# EAGLE schematic Control Panel High Level (EAGLE 6.5.0)
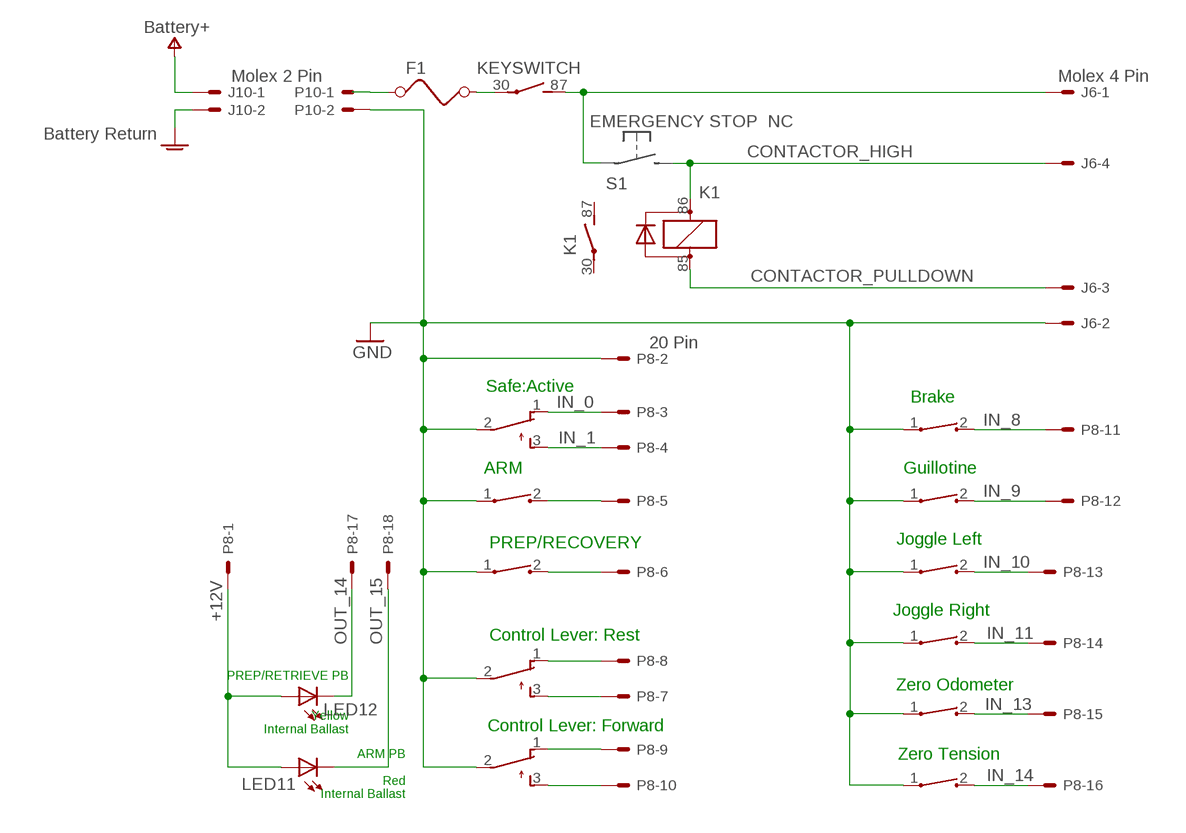
[diagram p0: schematic, sheet 1]

## Parts
F1  FUSE  [FUSE]
J6  Molex 4 Pin  22-23-2041  [22-23-2041]
J10  22-23-2021  [22-23-2021]
K1  CB1-D-P-12V  [CB1]
KEYSWITCH  Starter Relay  CB1A-P-12V  [CB1]
LED11  LED5MM  [LED5MM]
LED12  LED5MM  [LED5MM]
P8  20 Pin  C-GRID-20-70543  [70543-20]
P10  Molex 2 Pin  22-23-2021  [22-23-2021]
S2  TL32PO  [TL3XPO]
S3  TL32PO  [TL3XPO]
S8  TL32PO  [TL3XPO]
SW1  CT10-XXXX-A2  [CT10-XXXX-A2]
SW2  CT10-XXXX-A2  [CT10-XXXX-A2]
SW3  CT10-XXXX-A2  [CT10-XXXX-A2]
SW4  CT10-XXXX-A2  [CT10-XXXX-A2]
SW7  CT10-XXXX-A2  [CT10-XXXX-A2]
SW8  CT10-XXXX-A2  [CT10-XXXX-A2]
SW9  CT10-XXXX-A2  [CT10-XXXX-A2]
SW10  CT10-XXXX-A2  [CT10-XXXX-A2]

## Nets
+12V: LED11.A LED12.A P8.1
BATTERY+: J10.1 ; supply symbol labelled Battery+
CONTACTOR_HIGH: J6.4 K1.86(1:+)
CONTACTOR_PULLDOWN: J6.3 K1.85(1:-)
GND: J6.2 P8.2 P10.2 S2.2(P) S3.2(P) S8.2(P) SW1.1 SW2.1 SW3.1 SW4.1 SW7.1 SW8.1 SW9.1 SW10.1
GNDA: J10.2 ; supply symbol labelled Battery Return
IN_0: P8.3 S8.1(O)
IN_1: P8.4 S8.3(S)
IN_8: P8.11 SW7.2
IN_9: P8.12 SW8.2
IN_10: P8.13 SW9.2
IN_11: P8.14 SW10.2
IN_13: P8.15 SW2.2
IN_14: P8.16 SW1.2
N$1: F1.2 KEYSWITCH.30(2:P)
N$2: J6.1 KEYSWITCH.87(2:S)
N$3: F1.1 P10.1
N$4: P8.10 S3.3(S)
N$5: P8.9 S3.1(O)
N$6: P8.8 S2.1(O)
N$7: P8.7 S2.3(S)
N$8: P8.6 SW4.2
N$9: P8.5 SW3.2
OUT_14: LED12.K(C) P8.17
OUT_15: LED11.K(C) P8.18
Unconnected: K1.30(2:P) K1.87(2:S) KEYSWITCH.85 KEYSWITCH.86 P8.19 P8.20

## Notes on the sheet
- Safe:Active
- Brake
- ARM | Guillotine
- PREP/RECOVERY | Joggle Left
- Joggle Right
- Control Lever: Rest
- PREP/RETRIEVE PB
  
  
  Yellow
  Internal Ballast
- Zero Odometer
- Control Lever: Forward
- ARM PB
  
  Red
  Internal Ballast
- Zero Tension

## Library data of the parts
F1 = special:FUSE: FUSE 5 x 20 mm
J6 = con-molex:22-23-2041: .100" (2.54mm) Center Header - 4 Pin; MF: MOLEX; MPN: 22-23-2041; OC_FARNELL: 1462920; OC_NEWARK: 38C0355
J10 P10 = con-molex:22-23-2021: .100" (2.54mm) Center Header - 2 Pin; MF: MOLEX; MPN: 22-23-2021; OC_FARNELL: 1462926; OC_NEWARK: 25C3832
K1 = relay:CB1*V: HIGH POWER AUTOMOTIVE RELAY Form A with Diode NAiS Source: http://www.mew-europe.com/.. en_ds_61202_0000.pdf; MF: AROMAT/ MATSUSHITA; MPN: CB1-D-P-12V; OC_FARNELL: unknown; OC_NEWARK: 10C5390
KEYSWITCH = relay:CB*: HIGH POWER AUTOMOTIVE RELAY Form A NAiS Source: http://www.mew-europe.com/.. en_ds_61202_0000.pdf; MF: AROMAT/ MATSUSHITA; MPN: CB1A-P-12V; OC_FARNELL: 1270582; OC_NEWARK: 50B849
LED11 LED12 = led:LED: LED OSRAM: - CHIPLED LG R971, LG N971, LY N971, LG Q971, LY Q971, LO R971, LY R971 LH N974, LH R974 LS Q976, LO Q976, LY Q976 LO Q996 - Hyper CHIPLED LW Q18S LB Q993, LB Q99A, LB R99A - SideLED LS A670, LO A670, LY A670, LG A670, LP A670 LB A673, LV A673, LT A673, LW A673 LH A674 LY A675 LS A676, LA A676, LO A676, LY A676, LW A676 LS A679, LY A679, LG A679 - Hyper Micro SIDELED® LS Y876, LA Y876, LO Y876, LY Y876 LT Y87S - SmartLED LW L88C, LW L88S LB L89C, LB L89S, LG L890 LS L89K, LO L89K, LY L89K LS L896, LA L896, LO L896, LY L896 - TOPLED LS T670, LO T670, LY T670, LG T670, LP T670 LSG T670, LSP T670, LSY T670, LOP T670, LYG T670 LG T671, LOG T671, LSG T671 LB T673, LV T673, LT T673, LW T673 LH T674 LS T676, LA T676, LO T676, LY T676, LB T676, LH T676, LSB T676, LW T676 LB T67C, LV T67C, LT T67C, LS T67K, LO T67K, LY T67K, LW E67C LS E67B, LA E67B, LO E67B, LY E67B, LB E67C, LV E67C, LT E67C LW T67C LS T679, LY T679, LG T679 LS T770, LO T770, LY T770, LG T770, LP T770 LB T773, LV T773, LT T773, LW T773 LH T774 LS E675, LA E675, LY E675, LS T675 LS T776, LA T776, LO T776, LY T776, LB T776 LHGB T686 LT T68C, LB T68C - Hyper Mini TOPLED® LB M676 - Mini TOPLED Santana® LG M470 LS M47K, LO M47K, LY M47K Source: http://www.osram.convergy.de LUXEON: - LUMILED® LXK2-PW12-R00, LXK2-PW12-S00, LXK2-PW14-U00, LXK2-PW14-V00 LXK2-PM12-R00, LXK2-PM12-S00, LXK2-PM14-U00 LXK2-PE12-Q00, LXK2-PE12-R00, LXK2-PE12-S00, LXK2-PE14-T00, LXK2-PE14-U00 LXK2-PB12-K00, LXK2-PB12-L00, LXK2-PB12-M00, LXK2-PB14-N00, LXK2-PB14-P00, LXK2-PB14-Q00 LXK2-PR12-L00, LXK2-PR12-M00, LXK2-PR14-Q00, LXK2-PR14-R00 LXK2-PD12-Q00, LXK2-PD12-R00, LXK2-PD12-S00 LXK2-PH12-R00, LXK2-PH12-S00 LXK2-PL12-P00, LXK2-PL12-Q00, LXK2-PL12-R00 Source: www.luxeon.com KINGBRIGHT: KA-3528ASYC Source: www.kingbright.com
P8 = con-molex:C-GRID-20: CONNECTOR wire to board 2.54 mm (0.100") pitch header; OC_FARNELL: unknown; OC_NEWARK: unknown
S2 S3 S8 = switch:TL32PO: TINY SWITCH ON - MOM Source: http://www2.produktinfo.conrad.com/datenblaetter/700000-724999/705152-da-01-de-Subminiaturschalter_TL_36YO.pdf
SW1-SW4 SW7-SW10 = switch-coto:CT10-XXXX-: CT10 Series Molded Switch Source: www.cotorelay.com .. Coto_Technology__CT10-1530-G1.pdf